# EasyEDA Pro project 一体板.epro, schematic Schematic3
Create Date: 2023-07-03; Page Name: P1; Project Name: 独轮车七月; Schematic Name: Schematic3; Update Date: 2023-07-03; Company: 嘉立创EDA; Page Size: A4; Version: V1.0
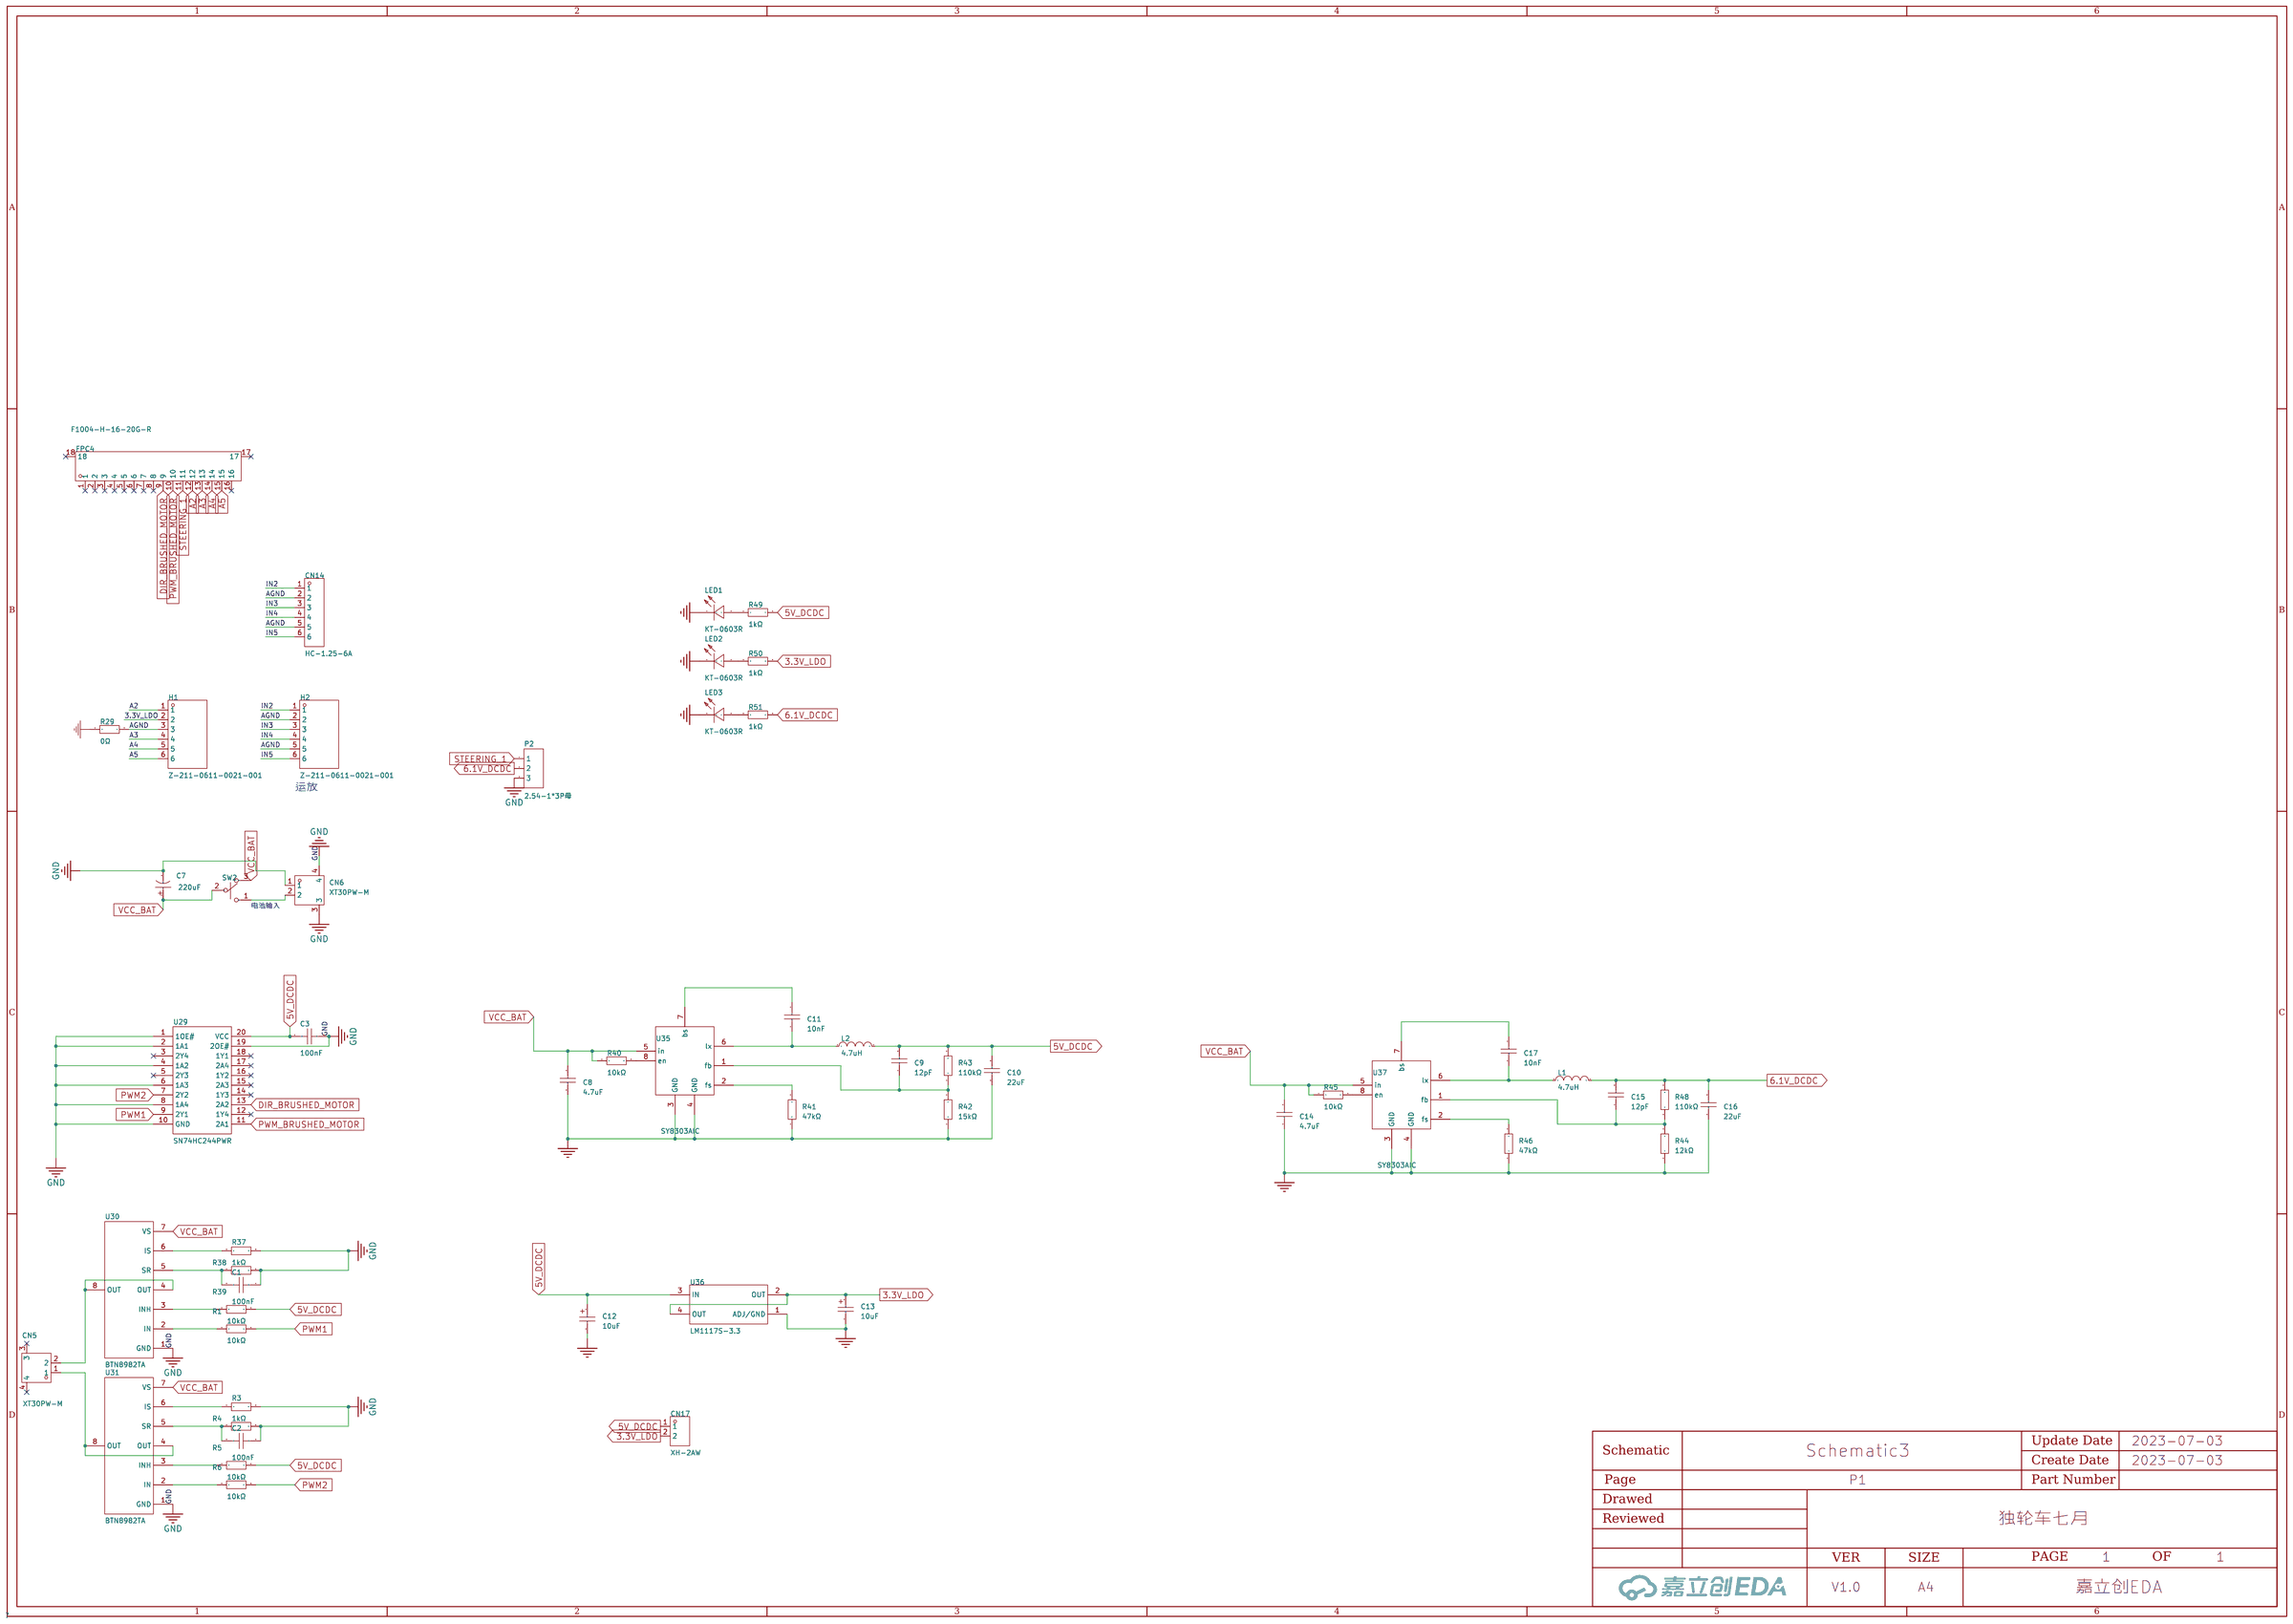
[diagram p3: schematic sheet]

## Parts
C1  100nF  [C0603]
C2  100nF  [C0603]
C3  100nF  [C0603]
C7  220uF  [CAP-TH_BD10.0-P5.00-D1.0-FD]
C8  4.7uF  [C1206]
C9  12pF  [C0603]
C10  22uF  [C1206]
C11  10nF  [C0603]
C12  10uF  [CAP-SMD_L3.2-W1.6-RD-C7171]
C13  10uF  [CAP-SMD_L3.2-W1.6-RD-C7171]
C14  4.7uF  [C1206]
C15  12pF  [C0603]
C16  22uF  [C1206]
C17  10nF  [C0603]
CN5  XT30PW-M  [CONN-TH_XT30PW-M]
CN6  XT30PW-M  [CONN-TH_XT30PW-M]
CN14  HC-1.25-6A  [CONN-TH_6P-P1.25_HCTL_HC-1.25-6A]
CN17  XH-2AW  [CONN-TH_XH-2AW_C2908611]
FPC4  F1004-H-16-20G-R  [CONN-SMD_F1004-H-16-20G-R]
H1  Z-211-0611-0021-001  [HDR-TH_6P-P2.54-V_Z-211-0611-0021-001]
H2  Z-211-0611-0021-001  [HDR-TH_6P-P2.54-V_Z-211-0611-0021-001]
L1  4.7uH  [IND-SMD_L5.4-W5.2_FXL0530]
L2  4.7uH  [IND-SMD_L5.4-W5.2_FXL0530]
LED1  KT-0603R  [LED0603-RD]
LED2  KT-0603R  [LED0603-RD]
LED3  KT-0603R  [LED0603-RD]
P2  2.54-1*3P母  [HDR-TH_3P-P2.54-V-F]
R1  10kΩ  [R0603]
R3  1kΩ  [R0603]
R4  0603WAF5100T5E  [R0603]
R5  10kΩ  [R0603]
R6  10kΩ  [R0603]
R29  0Ω  [R0603]
R37  1kΩ  [R0603]
R38  0603WAF5100T5E  [R0603]
R39  10kΩ  [R0603]
R40  10kΩ  [R0603]
R41  47kΩ  [R0603]
R42  15kΩ  [R0603]
R43  110kΩ  [R0603]
R44  12kΩ  [R0603]
R45  10kΩ  [R0603]
R46  47kΩ  [R0603]
R48  110kΩ  [R0603]
R49  1kΩ  [R0603]
R50  1kΩ  [R0603]
R51  1kΩ  [R0603]
SW2  MT-0-103-A101-M200-RS+PJ  [SW-TH_MT-0-103-A101-M200-RS]
U29  SN74HC244PWR  [TSSOP-20_L6.5-W4.4-P0.65-LS6.4-BL]
U30  BTN8982TA  [TO-263-7_L10.2-W10.4-P1.27-LS14.4-TL]
U31  BTN8982TA  [TO-263-7_L10.2-W10.4-P1.27-LS14.4-TL]
U35  SY8303AIC  [TSOT-23-8_L2.9-W1.6-P0.65-LS2.8-BR]
U36  LM1117S-3.3  [SOT-223-3_L6.5-W3.4-P2.30-LS7.0-BR]
U37  SY8303AIC  [TSOT-23-8_L2.9-W1.6-P0.65-LS2.8-BR]

## Library data of the parts
C1-C3 = CC0603KRX7R9BB104: 容值:100nF;精度:±10%;额定电压:50V;材质(温度系数):X7R;; LCSC Part Name: 100nF±10%50V; Supplier Part: C14663; Manufacturer: YAGEO(国巨); Supplier Footprint: 0603; JLCPCB Part Class: BasicPart; Datasheet: https://atta.szlcsc.com/upload/public/pdf/source/20170116/1484561234239.pdf; Supplier: LCSC; Tolerance: ±10%; Voltage Rated: 50V; Temperature Coefficient: X7R
C7 = KM227M050G13RR0VH2FP0: 容值:220uF;脚间距:5mm;纹波电流:-;额定电压:50V;等效串联电阻:-;精度:±20%;工作寿命:2000hrs 105;电容体直径:10mm;工作温度:-;电容体长度:13mm;; LCSC Part Name: 220uF50V; Supplier Part: C45105; Manufacturer: CX(承兴); Supplier Footprint: 径向引线,10x13mm; JLCPCB Part Class: ExtendedPart; Datasheet: https://atta.szlcsc.com/upload/public/pdf/source/20151029/1457707529682.pdf; Supplier: LCSC; Lead Spacing: 5mm; Rated Voltage: 50V; Tolerance: ±20%; Lifetime @ Temp: 2000hrs 105; φD: 10mm; L: 13mm
C8 C14 = 1206B475K500NT: 容值:4.7uF;精度:±10%;额定电压:50V;材质(温度系数):X7R;; LCSC Part Name: 4.7uF±10%50V; Supplier Part: C29823; Manufacturer: FH(风华); Supplier Footprint: 1206; JLCPCB Part Class: BasicPart; Datasheet: https://atta.szlcsc.com/upload/public/pdf/source/20170923/C29823_1506149432461988716.pdf; Supplier: LCSC; Tolerance: ±10%; Voltage Rated: 50V; Temperature Coefficient: X7R
C9 C15 = CL10C120JB8NNNC: 容值:12pF;精度:±5%;额定电压:50V;材质(温度系数):C0G;; LCSC Part Name: 12pF±5%50V; Supplier Part: C38523; Manufacturer: SAMSUNG(三星); Supplier Footprint: 0603; JLCPCB Part Class: BasicPart; Datasheet: https://atta.szlcsc.com/upload/public/pdf/source/20160103/1457707725436.pdf; Supplier: LCSC; Tolerance: ±5%; Voltage Rated: 50V; Temperature Coefficient: C0G
C10 C16 = CL31A226KAHNNNE: 容值:22uF;精度:±10%;额定电压:25V;材质(温度系数):X5R;; LCSC Part Name: 22uF±10%25V; Supplier Part: C12891; Manufacturer: SAMSUNG(三星); Supplier Footprint: 1206; JLCPCB Part Class: BasicPart; Datasheet: https://atta.szlcsc.com/upload/public/pdf/source/20160103/1457707667836.pdf; Supplier: LCSC; Tolerance: ±10%; Voltage Rated: 25V; Temperature Coefficient: X5R
C11 C17 = 0603B103K500NT: 容值:10nF;精度:±10%;额定电压:50V;材质(温度系数):X7R;; LCSC Part Name: 10nF±10%50V; Supplier Part: C57112; Manufacturer: FH(风华); Supplier Footprint: 0603; JLCPCB Part Class: BasicPart; Datasheet: https://atta.szlcsc.com/upload/public/pdf/source/20170923/C57112_1506149495135988846.pdf; Supplier: LCSC; Tolerance: ±10%; Voltage Rated: 50V; Temperature Coefficient: X7R
C12 C13 = TAJA106K016RNJ: 容值:10uF;精度:±10%;额定电压:16V;等效串联电阻:3Ω@100kHz;; LCSC Part Name: 10uF±10%16V; Supplier Part: C7171; Manufacturer: KyoceraAVX; Supplier Footprint: CASE-A-3216; JLCPCB Part Class: BasicPart; Datasheet: https://atta.szlcsc.com/upload/public/pdf/source/20160107/1457707748093.pdf; Supplier: LCSC; Tolerance: ±10%; Rated Voltage: 16V; Equivalent Series Resistance(ESR): 3Ω@100kHz; Operating Temperature: -55℃~+125℃
CN5 = XT30PW-M: Socket,DCsupply,XT30,male,PIN:2; LCSC Part Name: XT30PW-M公头; Supplier Part: C431092; Manufacturer: AMASS(艾迈斯); Supplier Footprint: ThroughHole; JLCPCB Part Class: ExtendedPart; Datasheet: https://atta.szlcsc.com/upload/public/pdf/source/20220222/6A9F22F7850E25B33E1BE430ADF8560B.pdf; Supplier: LCSC
CN6 = XT30PW-M: Socket,DCsupply,XT30,male,PIN:2; LCSC Part Name: AMASS(艾迈斯)航模插头卧式弯脚XT30PW-M公头; Supplier Part: C431092; Manufacturer: AMASS(艾迈斯); JLCPCB Part Class: ExtendedPart; Datasheet: https://atta.szlcsc.com/upload/public/pdf/source/20220222/6A9F22F7850E25B33E1BE430ADF8560B.pdf; Supplier: LCSC
CN14 = HC-1.25-6A: 参考系列:-;间距:1.25mm;插针结构:1x6P;排数:1;每排PIN数:6;行距:-;公母:公型插针;安装方式:直插;额定电流:1A;工作温度范围:-25℃~+85℃;; LCSC Part Name: 1.25mm1x6P直插; Supplier Part: C2845524; Manufacturer: HCTL(华灿天禄); Supplier Footprint: 插件,P=1.25mm; JLCPCB Part Class: ExtendedPart; Datasheet: https://atta.szlcsc.com/upload/public/pdf/source/20210729/C2845520_89EAA22C8D4DE2FB8A253230326912FB.pdf; Supplier: LCSC; Pitch: 1.25mm; Pins Structure: 1x6P; Number of Rows: 1; Number of PINs Per Row: 6; Gender: 公型插针; Mounting Style: 直插; Current Rating (Max): 1A; Operating Temperature Range: -25℃~+85℃
CN17 = XH-2AW_C2908611: 参考系列:XH;间距:2.54mm;插针结构:1x2P;排数:1;每排PIN数:2;行距:-;公母:公型插针;安装方式:弯插;额定电流:3A;工作温度范围:-25℃~+85℃;; LCSC Part Name: XH2.54mm1x2P弯插; Supplier Part: C2908611; Manufacturer: HCTL(华灿天禄); Supplier Footprint: 弯插,P=2.54mm; JLCPCB Part Class: ExtendedPart; Datasheet: https://atta.szlcsc.com/upload/public/pdf/source/20211021/ACA2D54D99493880102FCACAC8DAABA8.pdf; Supplier: LCSC; Reference Series: XH; Pitch: 2.54mm; Pins Structure: 1x2P; Number of Rows: 1; Number of PINs Per Row: 2; Gender: 公型插针; Mounting Style: 弯插; Current Rating (Max): 3A; Operating Temperature Range: -25℃~+85℃
FPC4 = F1004-H-16-20G-R: 间距:1mm;触点数量:16P;锁定特性:翻盖式;安装类型:卧贴;触点类型:双侧触点/上下接;; LCSC Part Name: 1mmP数:16P翻盖式双侧触点/上下接; Supplier Part: C668118; Manufacturer: XFCN(兴飞); Supplier Footprint: SMD,P=1mm; JLCPCB Part Class: ExtendedPart; Datasheet: https://atta.szlcsc.com/upload/public/pdf/source/20200618/C668118_823AC902B97FF0E52163AB5BF80076C2.pdf; Supplier: LCSC; Pitch: 1mm; Number of Contacts: 16P; Locking Feature: 翻盖式; Mounting Type: 卧贴; Contact Type: 双侧触点/上下接; Height Above Board: 2mm; FFC, FCB Thickness: 0.3mm
H1 H2 = Z-211-0611-0021-001: 排数:单排;总PIN位数:6;间距:2.54mm;插针结构:1x6P;行距:-;安装类型:直插;圆针/方针:方针;额定电流:-;额定电压:-;配合针长度:6mm;塑高:2.5mm;端接针长度:3mm;触头材质:黄铜;触头镀层:-;工作温度范围:-25℃~+105℃;颜色:黑色;; LCSC Part Name: 2.54mm1x6P直插方针; Supplier Part: C190819; Manufacturer: Nextron(正凌); Supplier Footprint: 插件,P=2.54mm; JLCPCB Part Class: ExtendedPart; Datasheet: https://atta.szlcsc.com/upload/public/pdf/source/20180731/C190819_A681B1380B379CDFC378560BE13D8C8F.pdf; Supplier: LCSC; Number of Rows: 单排; Number of Pins: 6; Pitch: 2.54mm; Pin Structure: 1x6P; Mounting Type: 直插; Circluar Pins/Square Pins: 方针; Length of Mating Pin: 6mm; Insulation Height: 2.5mm; Length of End Connection Pin: 3mm; Contact Material: 黄铜; Operating Temperature Range: -25℃~+105℃; Color: 黑色
L1 L2 = FXL0530-4R7-M: 电感值:4.7uH;精度:±20%;额定电流:4.5A;饱和电流(Isat):5A;; LCSC Part Name: 4.7uH±20%4.5A50mΩ; Supplier Part: C177246; Manufacturer: cjiang(长江微电); Supplier Footprint: SMD,5.2x5.4mm; JLCPCB Part Class: ExtendedPart; Datasheet: https://atta.szlcsc.com/upload/public/pdf/source/20190322/C177246_D81D0671B72FD9DE4B58607F480A6AE0.pdf; Supplier: LCSC; Tolerance: ±20%; Rated Current: 4.5A; Saturation Current (Isat): 5A; DC Resistance (DCR): 50mΩ
LED1-LED3 = KT-0603R: 发光颜色:红灯;二极管配置:-;透镜颜色:-;主波长:-;色温:-;功率:-;发光角度:-;安装方式:-;工作温度:-40℃~+85℃;; LCSC Part Name: 0603红灯高亮; Supplier Part: C2286; Manufacturer: KENTO; Supplier Footprint: 0603; JLCPCB Part Class: BasicPart; Datasheet: https://atta.szlcsc.com/upload/public/pdf/source/20160616/1466072038404.pdf; Supplier: LCSC; Emitted Color: 红灯; Operating Temperature: -40℃~+85℃
P2 = 2.54-1*3P母: 排数:单排;总孔位数:3;间距:2.54mm;行距:-;安装类型:直插;塑高:-;触头材质:-;触头镀层:金;; LCSC Part Name: 2.54mm环保镀金; Supplier Part: C146243; Manufacturer: BOOMELE(博穆精密); Supplier Footprint: 插件,P=2.54mm; JLCPCB Part Class: ExtendedPart; Supplier: LCSC; Number of Rows: 单排; Number of Holes: 3; Pitch: 2.54mm; Mounting Type: 直插; Contact Plating: 金
R1 R5 R6 R39 R40 R45 = 0603WAF1002T5E: 电阻类型:厚膜电阻;阻值:10kΩ;精度:±1%;功率:100mW;温度系数:±100ppm/℃;最大工作电压:75V;工作温度范围:-55℃~+155℃;; LCSC Part Name: 10kΩ±1%100mW; Supplier Part: C25804; Manufacturer: UNI-ROYAL(厚声); Supplier Footprint: 0603; JLCPCB Part Class: BasicPart; Datasheet: https://atta.szlcsc.com/upload/public/pdf/source/20200306/C422600_1E6D84923E4A46A82E41ADD87F860B5C.pdf; Supplier: LCSC; Type: 厚膜电阻; Tolerance: ±1%; Power(Watts): 100mW; Temperature Coefficient: ±100ppm/℃; Overload Voltage (Max): 75V; Operating Temperature Range: -55℃~+155℃
R3 R37 = 0603WAF1001T5E: 电阻类型:厚膜电阻;阻值:1kΩ;精度:±1%;功率:100mW;温度系数:±100ppm/℃;最大工作电压:75V;工作温度范围:-55℃~+155℃;; LCSC Part Name: 1kΩ±1%100mW; Supplier Part: C21190; Manufacturer: UNI-ROYAL(厚声); Supplier Footprint: 0603; JLCPCB Part Class: BasicPart; Datasheet: https://atta.szlcsc.com/upload/public/pdf/source/20200306/C422600_1E6D84923E4A46A82E41ADD87F860B5C.pdf; Supplier: LCSC; Type: 厚膜电阻; Tolerance: ±1%; Power(Watts): 100mW; Temperature Coefficient: ±100ppm/℃; Overload Voltage (Max): 75V; Operating Temperature Range: -55℃~+155℃
R4 R38 = 0603WAF5100T5E: LCSC Part Name: 510Ω(5100)±1%编带; Supplier Part: C23193; Manufacturer: UNI-ROYAL(厚声); Supplier Footprint: 0603; JLCPCB Part Class: BasicPart; Datasheet: https://atta.szlcsc.com/upload/public/pdf/source/20170920/C23193_1505901125164982575.pdf; Supplier: LCSC
R29 = 0603WAF0000T5E: 温度系数:-;精度:±1%;阻值:0Ω;功率:1/10W;最大工作电压:75V;工作温度范围:-55℃~+155℃;; LCSC Part Name: 0Ω±1%; Supplier Part: C21189; Manufacturer: UNI-ROYAL(厚声); Supplier Footprint: 0603; JLCPCB Part Class: BasicPart; Datasheet: https://atta.szlcsc.com/upload/public/pdf/source/20170920/C21189_1505887441435980537.pdf; Supplier: LCSC; Tolerance: ±1%; Power(Watts): 1/10W; Overload Voltage (Max): 75V; Operating Temperature Range: -55℃~+155℃
R41 R46 = 0603WAF4702T5E: 电阻类型:厚膜电阻;阻值:47kΩ;精度:±1%;功率:100mW;; LCSC Part Name: 47kΩ±1%100mW; Supplier Part: C25819; Manufacturer: UNI-ROYAL(厚声); Supplier Footprint: 0603; JLCPCB Part Class: BasicPart; Datasheet: https://atta.szlcsc.com/upload/public/pdf/source/20200306/C422600_1E6D84923E4A46A82E41ADD87F860B5C.pdf; Supplier: LCSC; Type: 厚膜电阻; Tolerance: ±1%; Power(Watts): 100mW; Temperature Coefficient: ±100ppm/℃; Overload Voltage (Max): 75V; Operating Temperature Range: -55℃~+155℃
R42 = 0603WAF1502T5E: 电阻类型:厚膜电阻;阻值:15kΩ;精度:±1%;功率:100mW;; LCSC Part Name: 15kΩ±1%100mW; Supplier Part: C22809; Manufacturer: UNI-ROYAL(厚声); Supplier Footprint: 0603; JLCPCB Part Class: BasicPart; Datasheet: https://atta.szlcsc.com/upload/public/pdf/source/20200306/C422600_1E6D84923E4A46A82E41ADD87F860B5C.pdf; Supplier: LCSC; Type: 厚膜电阻; Tolerance: ±1%; Power(Watts): 100mW; Temperature Coefficient: ±100ppm/℃; Overload Voltage (Max): 75V; Operating Temperature Range: -55℃~+155℃
R43 R48 = 0603WAF1103T5E: 电阻类型:厚膜电阻;阻值:110kΩ;精度:±1%;功率:100mW;; LCSC Part Name: 110kΩ±1%100mW; Supplier Part: C25805; Manufacturer: UNI-ROYAL(厚声); Supplier Footprint: 0603; JLCPCB Part Class: BasicPart; Datasheet: https://atta.szlcsc.com/upload/public/pdf/source/20200306/C422600_1E6D84923E4A46A82E41ADD87F860B5C.pdf; Supplier: LCSC; Type: 厚膜电阻; Tolerance: ±1%; Power(Watts): 100mW; Temperature Coefficient: ±100ppm/℃; Overload Voltage (Max): 75V; Operating Temperature Range: -55℃~+155℃
R44 = 0603WAF1202T5E: 电阻类型:厚膜电阻;阻值:12kΩ;精度:±1%;功率:100mW;; LCSC Part Name: 12kΩ±1%100mW; Supplier Part: C22790; Manufacturer: UNI-ROYAL(厚声); Supplier Footprint: 0603; JLCPCB Part Class: BasicPart; Datasheet: https://atta.szlcsc.com/upload/public/pdf/source/20200306/C422600_1E6D84923E4A46A82E41ADD87F860B5C.pdf; Supplier: LCSC; Type: 厚膜电阻; Tolerance: ±1%; Power(Watts): 100mW; Temperature Coefficient: ±100ppm/℃; Overload Voltage (Max): 75V; Operating Temperature Range: -55℃~+155℃
R49-R51 = 0603WAF1001T5E: 电阻类型:厚膜电阻;阻值:1kΩ;精度:±1%;功率:100mW;; LCSC Part Name: 1kΩ±1%100mW; Supplier Part: C21190; Manufacturer: UNI-ROYAL(厚声); Supplier Footprint: 0603; JLCPCB Part Class: BasicPart; Datasheet: https://atta.szlcsc.com/upload/public/pdf/source/20200306/C422600_1E6D84923E4A46A82E41ADD87F860B5C.pdf; Supplier: LCSC; Type: 厚膜电阻; Tolerance: ±1%; Power(Watts): 100mW; Temperature Coefficient: ±100ppm/℃; Overload Voltage (Max): 75V; Operating Temperature Range: -55℃~+155℃
SW2 = MT-0-103-A101-M200-RS+PJ: 额定电流:5A;额定电压(AC):125V;电路结构:单刀双掷;钮柄形状:圆柱钮柄;引脚样式:焊片;安装方式:直插;工作温度:-25~+85;开关长度:13mm;开关宽度:8mm;开关高度:28.6mm;; LCSC Part Name: 小型钮子三脚三档(五件套); Supplier Part: C1788493; Manufacturer: YUENFUNG(源丰); Supplier Footprint: 插件; JLCPCB Part Class: ExtendedPart; Datasheet: https://atta.szlcsc.com/upload/public/pdf/source/20201225/C1788493_608759AD4D4A20FF90A03E3E3321FD91.pdf; Supplier: LCSC; Contact Current: 5A; Voltage Rating (AC): 125V; Circuit: 单刀双掷; Actuator Type: 圆柱钮柄; Pin Style: 焊片; Mounting Style: 直插; Operating Temperature: -25~+85; Switch Length: 13mm; Switch Width: 8mm; Switch Height: 28.6mm
U29 = SN74HC244PWR: 类型:缓冲器，非反相;电源电压:2V~6V;输入类型:-;输出类型:三态;低电平输出电流(IOL):7.8mA;高电平输出电流(IOH):7.8mA;工作温度:-40℃~+85℃;; Supplier Part: C6835; Manufacturer: TI(德州仪器); Supplier Footprint: TSSOP-20; JLCPCB Part Class: ExtendedPart; Datasheet: https://atta.szlcsc.com/upload/public/pdf/source/20140704/1457707115574.pdf; Supplier: LCSC; Type: 缓冲器，非反相; Supply Voltage: 2V~6V; output type: 三态; Current-OutputLow: 7.8mA; Current-OutputHigh: 7.8mA; Operating temperature: -40℃~+85℃
U30 U31 = BTN8982TA: 高电流PN半桥驱动IC; Supplier Part: C74175; Manufacturer: Infineon(英飞凌); Supplier Footprint: TO-263-7; JLCPCB Part Class: ExtendedPart; Datasheet: https://atta.szlcsc.com/upload/public/pdf/source/20170221/1487670306389.pdf; Supplier: LCSC
U35 U37 = SY8303AIC: 功能类型:降压型;同步整流:-;输出通道数:-;拓扑结构:-;输入电压:-;输出电流(最大值):-;开关频率:-;; LCSC Part Name: 降压型; Supplier Part: C97054; Manufacturer: silergy(矽力杰); Supplier Footprint: TSOT-23-8; JLCPCB Part Class: ExtendedPart; Datasheet: https://atta.szlcsc.com/upload/public/pdf/source/20170308/1488958431714.pdf; Supplier: LCSC; Function: 降压型
U36 = LM1117S-3.3: 输出类型:固定;输出极性:正;最大输入电压:12V;输出电压:3.3V;输出电流:1A;电源纹波抑制比(PSRR):75dB@(120Hz);; LCSC Part Name: 输入12V输出3.3V1A; Supplier Part: C126027; Manufacturer: HTC; Supplier Footprint: SOT-223; JLCPCB Part Class: ExtendedPart; Datasheet: https://atta.szlcsc.com/upload/public/pdf/source/20170814/C126027_1502678373551885899.pdf; Supplier: LCSC; Output Type: 固定; Output Polarity: 正; Number of Outputs: 1; Maximum Input Voltage: 12V; Output Voltage: 3.3V; Dropout Voltage: 1.3V@(1A); Output Current: 1A; Power Supply Rejection Ratio (PSRR): 75dB@(120Hz)

## Nets
3.3V_LDO: C13.1 CN17.2 H1.2 R50.2 U36.2(OUT) U36.4(OUT)
5V_DCDC: C3.2 C9.2 C10.2 C12.1 CN17.1 L2.2 R5.2 R39.2 R43.2 R49.2 U29.20(VCC) U36.3(IN)
6.1V_DCDC: C15.2 C16.2 L1.2 P2.2 R48.2 R51.2
AGND: CN14.2 CN14.5 H1.3 H2.2 H2.5 R29.2
GND: C1.1 C2.1 C3.1 C7.2 C8.1 C10.1 C12.2 C13.2 C14.1 C16.1 CN6.1 CN6.3 CN6.4 LED1.1(K) LED2.1(K) LED3.1(K) P2.3 R3.2 R4.2 R29.1 R37.2 R38.2 R41.1 R42.1 R44.1 R46.1 U29.1(1OE#) U29.2(1A1) U29.4(1A2) U29.6(1A3) U29.8(1A4) U29.10(GND) U29.19(2OE#) U30.1(GND) U31.1(GND) U35.3(GND) U35.4(GND) U36.1(ADJ/GND) U37.3(GND) U37.4(GND)
VCC_BAT: C7.1 C8.2 C14.2 R40.1 R45.1 SW2.2 SW2.3 U30.7(VS) U31.7(VS) U35.5(in) U37.5(in)
A2: FPC4.12 H1.1
A3: FPC4.13 H1.4
A4: FPC4.14 H1.5
A5: FPC4.15 H1.6
DIR_BRUSHED_MOTOR: FPC4.9 U29.13(2A2)
IN2: CN14.1 H2.1
IN3: CN14.3 H2.3
IN4: CN14.4 H2.4
IN5: CN14.6 H2.6
PWM1: R1.2 U29.9(2Y1)
PWM2: R6.2 U29.7(2Y2)
PWM_BRUSHED_MOTOR: FPC4.10 U29.11(2A1)
STEERING_1: FPC4.11 P2.1
$1N17060: R37.1 U30.6(IS)
$1N17062: C1.2 R38.1 U30.5(SR)
$1N17063: R39.1 U30.3(INH)
$1N17065: R1.1 U30.2(IN)
$1N17067: R3.1 U31.6(IS)
$1N17069: C2.2 R4.1 U31.5(SR)
$1N17070: R5.1 U31.3(INH)
$1N17072: R6.1 U31.2(IN)
$1N17085: CN6.2 SW2.1
$1N17086: CN5.1 U31.4(OUT) U31.8(OUT)
$1N17087: CN5.2 U30.4(OUT) U30.8(OUT)
$1N22931: R40.2 U35.8(en)
$1N23070: R41.2 U35.2(fs)
$1N23279: C9.1 R42.2 R43.1 U35.1(fb)
$1N23414: C11.2 U35.7(bs)
$1N25056: R45.2 U37.8(en)
$1N25058: R46.2 U37.2(fs)
$1N25059: C15.1 R44.2 R48.1 U37.1(fb)
$1N25062: C17.2 U37.7(bs)
$1N25742: C17.1 L1.1 U37.6(lx)
$1N25780: C11.1 L2.1 U35.6(lx)
$1N27238: LED1.2(A) R49.1
$1N27406: LED2.2(A) R50.1
$1N27587: LED3.2(A) R51.1

Not connected (* = marked no-connect by the designer): CN5 3* 4*; FPC4 1* 2* 3* 4* 5* 6* 7* 8* 16* 17* 18*; U29 3(2Y4)* 5(2Y3)* 12(1Y4)* 14(1Y3)* 15(2A3)* 16(1Y2)* 17(2A4)* 18(1Y1)*

## Notes on the sheet
- 运放
- 电池输入
